# Altium schematic sheet 5Vto12V_Boost_Converter(Motors).SchDoc
size A; SheetNumber: 1; SheetTotal: 1
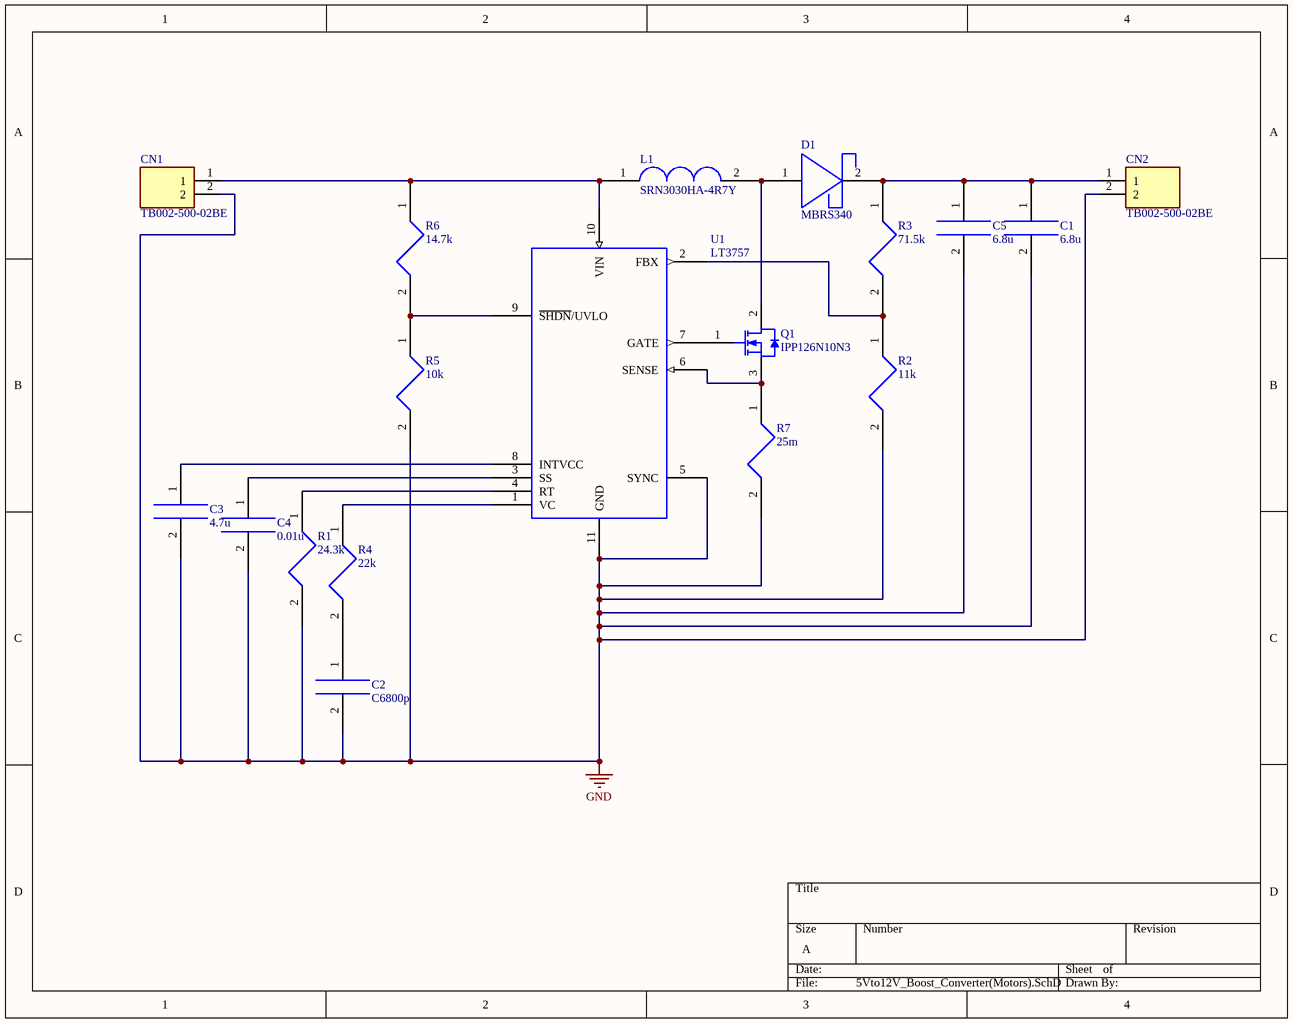
[diagram p0: 5Vto12V_Boost_Converter(Motors).SchDoc]

## Parts
C1  6.8u  [C6.8u]
C2  C6800p  [C6800p]
C3  4.7u  [C4.7u]
C4  0.01u  [C0.01u]
C5  6.8u  [C6.8u]
CN1  TB002-500-02BE  [TB002-500-02BE]
CN2  TB002-500-02BE  [TB002-500-02BE]
D1  MBRS340  [MBRS340]
L1  SRN3030HA-4R7Y  [SRN3030HA-4R7Y(Inductor-1)]
Q1  IPP126N10N3  [IPP126N10N3]
R1  24.3k  [R24.3k]
R2  11k  [R11k]
R3  71.5k  [R71.5k]
R4  22k  [R22k]
R5  10k  [R10k]
R6  14.7k  [R14.7k]
R7  25m  [R25m]
U1  LT3757  [LT3757]

## Nets
GND: C1.2 C2.2 C3.2 C4.2 C5.2 CN1.2 CN2.2 R1.2 R2.2 R5.2 R7.2 U1.5(SYNC) U1.11(GND)
NetC1_1: C1.1 C5.1 CN2.1 D1.2 R3.1
NetC2_1: C2.1 R4.2
NetC3_1: C3.1 U1.8(INTVCC)
NetC4_1: C4.1 U1.3(SS)
NetCN1_1: CN1.1 L1.1 R6.1 U1.10(VIN)
NetD1_1: D1.1 L1.2 Q1.2(DRAIN)
NetQ1_1: Q1.1(GATE) U1.7(GATE)
NetQ1_3: Q1.3(SOURCE) R7.1 U1.6(SENSE)
NetR1_1: R1.1 U1.4(RT)
NetR2_1: R2.1 R3.2 U1.2(FBX)
NetR4_1: R4.1 U1.1(VC)
NetR5_1: R5.1 R6.2 U1.9(~{SHDN}/UVLO)

## Library data of the parts
C1 C5 = C6.8u
C3 = C4.7u
C4 = C0.01u: SMD 0.01uF Capacitor
L1 = SRN3030HA-4R7Y(Inductor-1)
R1 = R24.3k
R2 = R11k
R3 = R71.5k
R4 = R22k
R5 = R10k: SMD 10k Resistor
R6 = R14.7k
R7 = R25m